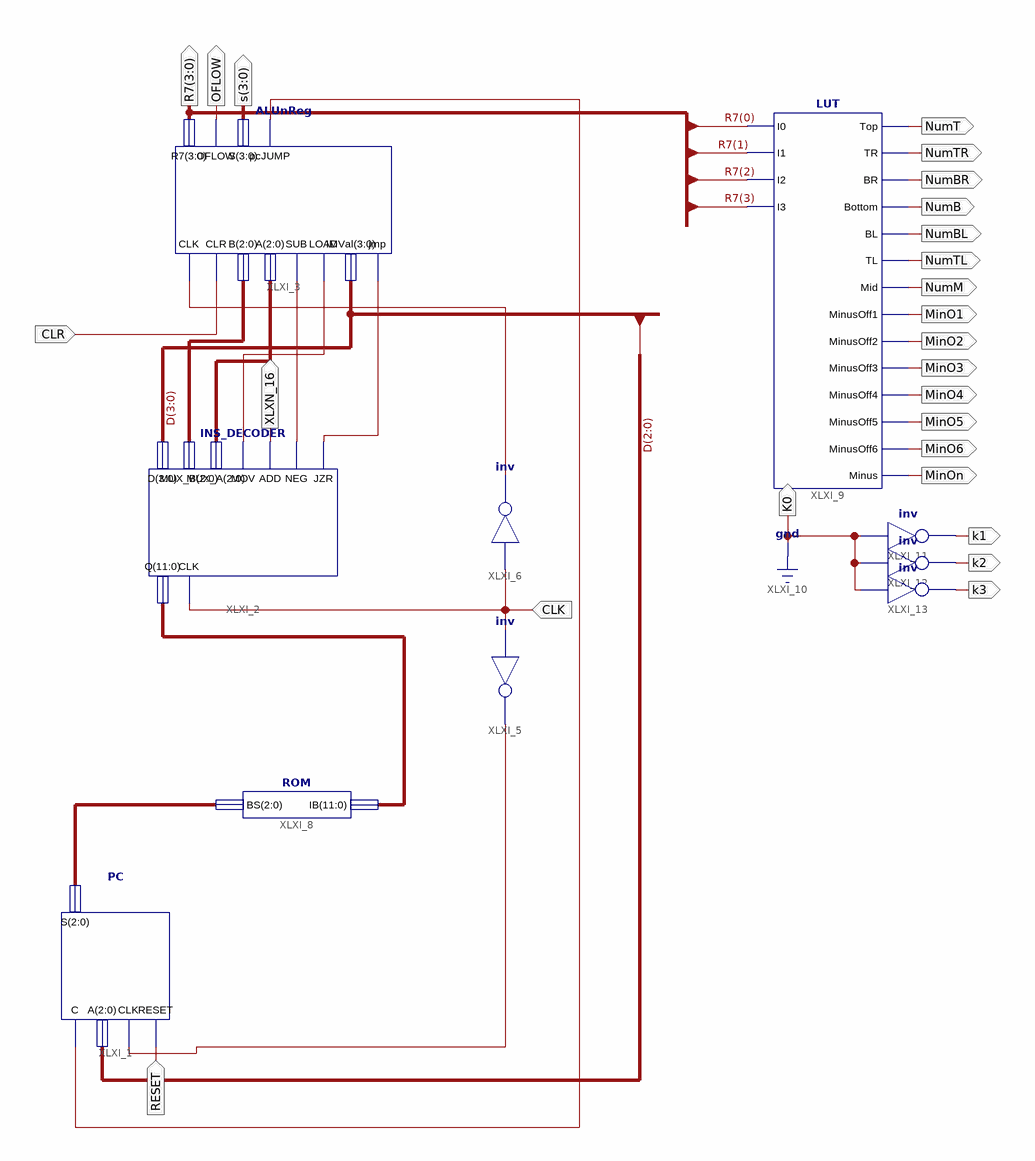
[diagram p0: schematic sheet 1]
// Xilinx ISE schematic finalProc.sch (spartan3e) as structural Verilog: 10 symbols, 25 ports
module finalProc (
  input  CLR,
  input  RESET,
  input  CLK,
  output XLXN_16,
  output OFLOW,
  output [3:0] R7,
  output [3:0] s,
  output NumT,
  output NumTR,
  output NumBR,
  output NumB,
  output NumBL,
  output NumTL,
  output NumM,
  output MinO1,
  output MinO2,
  output MinO3,
  output MinO4,
  output MinO5,
  output MinO6,
  output MinOn,
  output K0,
  output k1,
  output k2,
  output k3
);

  wire XLXN_4, XLXN_5, XLXN_6, XLXN_11, XLXN_23, XLXN_25;
  wire [2:0] XLXN_1, XLXN_8, XLXN_9;
  wire [3:0] D;
  wire [11:0] XLXN_2;

  PC XLXI_1 (.A(D[2:0]), .C(XLXN_11), .CLK(XLXN_23), .RESET(RESET), .S(XLXN_1));
  INS_DECODER XLXI_2 (
    .ADD(XLXN_16), .CLK(CLK), .D(D), .JZR(XLXN_4), .MOV(XLXN_6), .MUX_A(XLXN_9), .MUX_B(XLXN_8),
    .NEG(XLXN_5), .Q(XLXN_2));
  ALUnReg XLXI_3 (
    .A(XLXN_9), .B(XLXN_8), .CLK(XLXN_25), .CLR(CLR), .IMVal(D), .jmp(XLXN_4), .LOAD(XLXN_6), .OFLOW(OFLOW),
    .pcJUMP(XLXN_11), .R7(R7), .S(s), .SUB(XLXN_5));
  not XLXI_5 (XLXN_23, CLK);
  not XLXI_6 (XLXN_25, CLK);
  ROM XLXI_8 (.BS(XLXN_1), .IB(XLXN_2));
  LUT XLXI_9 (
    .BL(NumBL), .Bottom(NumB), .BR(NumBR), .I0(R7[0]), .I1(R7[1]), .I2(R7[2]), .I3(R7[3]), .Mid(NumM),
    .Minus(MinOn), .MinusOff1(MinO1), .MinusOff2(MinO2), .MinusOff3(MinO3), .MinusOff4(MinO4),
    .MinusOff5(MinO5), .MinusOff6(MinO6), .TL(NumTL), .Top(NumT), .TR(NumTR));
  not XLXI_11 (k1, 1'b0);
  not XLXI_12 (k2, 1'b0);
  not XLXI_13 (k3, 1'b0);

  assign K0 = 1'b0;
endmodule
